# EasyEDA Pro project PicoKey.epro

# Schematic Schematic1
Board Name: Board1; Create Date: 2025-10-05; Page Name: P1; Project Name: PicoKey; Schematic Name: Schematic1; Update Date: 2025-10-05; Company: Astralis; Page Size: A4; Version: V1.0
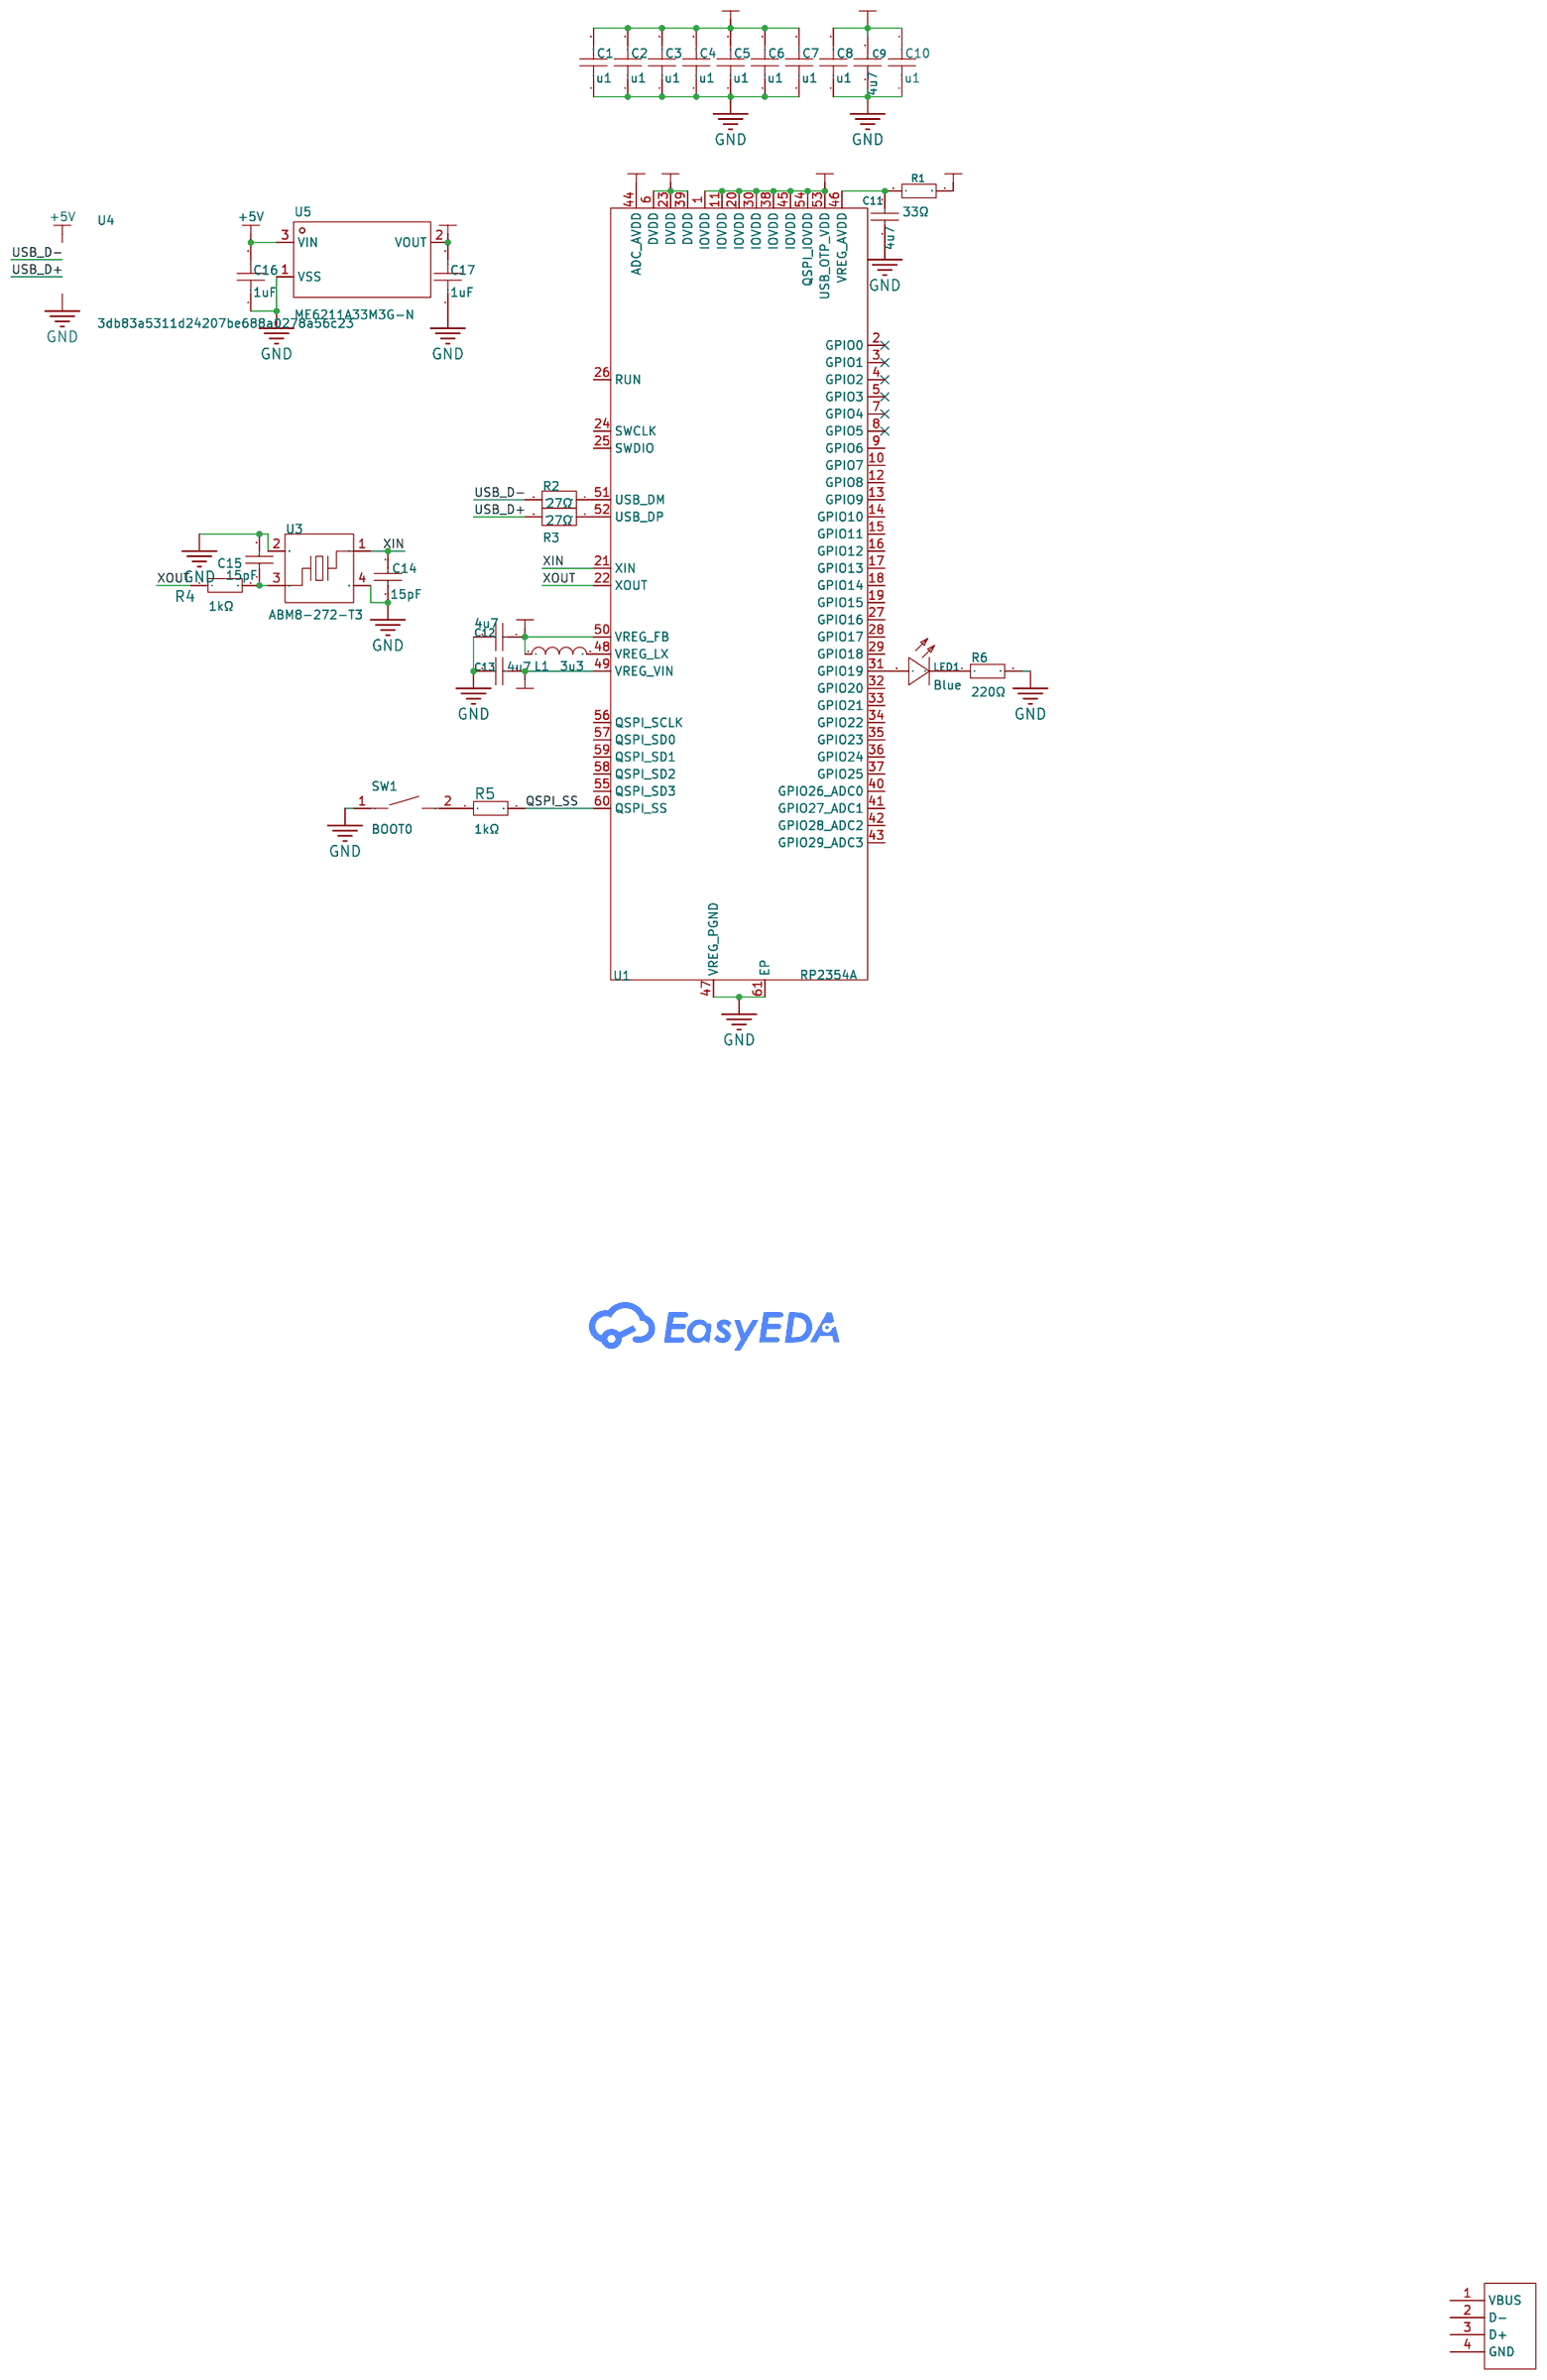
[diagram p0: schematic sheet]

## Parts
C1  u1  [C0402_custom]
C2  u1  [C0402_custom]
C3  u1  [C0402_custom]
C4  u1  [C0402_custom]
C5  u1  [C0402_custom]
C6  u1  [C0402_custom]
C7  u1  [C0402_custom]
C8  u1  [C0402_custom]
C9  4u7  [C0402_custom]
C10  u1  [C0402_custom]
C11  4u7  [C0402_custom]
C12  4u7  [C0402_wider]
C13  4u7  [C0402_wider]
C14  15pF  [C0402_custom]
C15  15pF  [C0402_custom]
C16  1uF  [C0402]
C17  1uF  [C0402]
L1  3u3  [IND-SMD_L2.0-W1.6_AOTA-B201610S3R3-101-T]
LED1  Blue  [LED0402-RD_BLUE]
R1  33Ω  [R0402]
R2  27Ω  [R0402]
R3  27Ω  [R0402]
R4  1kΩ  [R0402]
R5  1kΩ  [R0402]
R6  220Ω  [R0402]
SW1  BOOT0  [SW-SMD_L3.9-W3.0-P4.45]
U1  RP2354A  [QFN-60_L7.0-W7.0-P0.40-TL-EP3.4]
U3  ABM8-272-T3  [CRYSTAL-SMD_4P-L3.2-W2.5-BL]
U4  3db83a5311d24207be688a0278a56c23  [USB-A_PCB]
U5  ME6211A33M3G-N  [SOT-23-3_L2.9-W1.6-P1.90-LS2.8-BR]

## Library data of the parts
C1-C8 C10 = CL05B104KO5NNNC: Capacitance:100nF Tolerance:±10% Tolerance:±10% Voltage Rating:16V Temperature Coefficient:X7R; LCSC Part Name: 100nF ±10% 16V; Supplier Part: C1525; Manufacturer: SAMSUNG(三星); Supplier Footprint: 0402; Datasheet: https://item.szlcsc.com/datasheet/CL05B104KO5NNNC/1877.html; Supplier: LCSC; Tolerance: ±10%; Voltage Rating: 16V; Temperature Coefficient: X7R
C9 C11-C13 = CL05A475MP5NRNC: Capacitance:4.7uF Tolerance:±20% Tolerance:±20% Voltage Rating:10V Temperature Coefficient:X5R; LCSC Part Name: 4.7uF ±20% 10V; Supplier Part: C23733; Manufacturer: SAMSUNG(三星); Supplier Footprint: 0402; Datasheet: https://item.szlcsc.com/datasheet/CL05A475MP5NRNC/24469.html; Supplier: LCSC; Tolerance: ±20%; Voltage Rating: 10V; Temperature Coefficient: X5R
C14 C15 = 0402CG150J500NT: Capacitance: Tolerance:±5% Tolerance:±5% Voltage Rated: Temperature Coefficient:; LCSC Part Name: 15pF ±5% 50V; Supplier Part: C1548; Manufacturer: FH(风华); Supplier Footprint: 0402; JLCPCB Part Class: Basic Part; Datasheet: https://atta.szlcsc.com/upload/public/pdf/source/20200305/C486355_26A10D38EF8C2A5C37091D0039909270.pdf; Supplier: LCSC; Tolerance: ±5%
C16 C17 = CL05A105KA5NQNC: Capacitance:1uF Tolerance:±10% Tolerance:±10% Voltage Rating:25V Temperature Coefficient:X5R; LCSC Part Name: 1uF ±10% 25V; Supplier Part: C52923; Manufacturer: SAMSUNG(三星); Supplier Footprint: 0402; Datasheet: https://item.szlcsc.com/datasheet/CL05A105KA5NQNC/53938.html; Supplier: LCSC; Tolerance: ±10%; Voltage Rating: 25V; Temperature Coefficient: X5R
L1 = AOTA-B201610S3R3-101-T: Supplier Part: C42411119; Manufacturer: ABRACON; Supplier Footprint: 0806; Datasheet: https://item.szlcsc.com/datasheet/AOTA-B201610S3R3-101-T/44392932.html; Supplier: LCSC
LED1 = MHT136UBCT: Emitted Color:Blue Power Dissipation:95mW Forward Current:5mA Dominant Wavelength:460nm~475nm Dominant Wavelength:460nm~475nm Peak Wavelength:468nm Diode Configuration:- Lens Color:无色透明透镜 Color Temperature:- Color Temperature:- Viewing Angle:120° Mounting; LCSC Part Name: 蓝灯; Supplier Part: C401112; Manufacturer: MEIHUA(美华); Supplier Footprint: 0402; Datasheet: https://atta.szlcsc.com/upload/public/pdf/source/20190702/C401112_5DC3FC64C29106EB5A730797BBB1C3EC.pdf; Supplier: LCSC; Power Dissipation: 95mW; Forward Current: 5mA; Dominant Wavelength: 460nm~475nm; Peak Wavelength: 468nm; Lens Color: 无色透明透镜; Viewing Angle: 120°; Operating Temperature: -35℃~+85℃
R1 = 0402WGF330JTCE: Type:Thick Film Resistors Resistance:33Ω Tolerance:±1% Tolerance:±1% Power(Watts): Overload Voltage (Max): Temperature Coefficient:±100ppm/℃ Temperature Coefficient:±100ppm/℃ Operating Temperature Range:-55℃~+155℃ Operating Temperature Range:-55℃~+155℃; LCSC Part Name: 33Ω ±1% 62.5mW 厚膜电阻; Supplier Part: C25105; Manufacturer: UNI-ROYAL(厚声); Supplier Footprint: 0402; Datasheet: https://atta.szlcsc.com/upload/public/pdf/source/20200306/C422600_1E6D84923E4A46A82E41ADD87F860B5C.pdf; Supplier: LCSC; Type: Thick Film Resistors; Tolerance: ±1%; Temperature Coefficient: ±100ppm/℃; Operating Temperature Range: -55℃~+155℃
R2 R3 = WR04X270JTL_C384351: Type:Thick Film Resistor Resistance:27Ω Tolerance:±5% Tolerance:±5% Power(Watts):62.5mW Voltage-Supply(Max):50V Temperature Coefficient:±100ppm/℃ Temperature Coefficient:±100ppm/℃ Operating Temperature:-55℃~+155℃ Operating Temperature:-55℃~+155℃; LCSC Part Name: 厚膜电阻 27Ω ±5% 62.5mW; Supplier Part: C384351; Manufacturer: Walsin(华新科); Manufacturer Part: WR04X270JTL; Supplier Footprint: 0402; JLCPCB Part Class: Extended Part; Datasheet: https://atta.szlcsc.com/upload/public/pdf/source/20191217/C470037_D99261402F77DA8B1D609223749D445A.pdf; Supplier: LCSC; Type: Thick Film Resistor; Tolerance: ±5%; Power(Watts): 62.5mW; Voltage-Supply(Max): 50V; Temperature Coefficient: ±100ppm/℃; Operating Temperature: -55℃~+155℃
R4 R5 = 0402WGF1001TCE: Type:Thick Film Resistors Resistance:1kΩ Tolerance:±1% Tolerance:±1% Power(Watts): Overload Voltage (Max): Temperature Coefficient:±100ppm/℃ Temperature Coefficient:±100ppm/℃ Operating Temperature Range:-55℃~+155℃ Operating Temperature Range:-55℃~+155℃; LCSC Part Name: 1kΩ ±1% 62.5mW 厚膜电阻; Supplier Part: C11702; Manufacturer: UNI-ROYAL(厚声); Supplier Footprint: 0402; JLCPCB Part Class: Basic Part; Datasheet: https://atta.szlcsc.com/upload/public/pdf/source/20200306/C422600_1E6D84923E4A46A82E41ADD87F860B5C.pdf; Supplier: LCSC; Type: Thick Film Resistors; Tolerance: ±1%; Temperature Coefficient: ±100ppm/℃; Operating Temperature Range: -55℃~+155℃
R6 = RC0402FR-07220RL: Type:Thick Film Resistor Resistance:220Ω Tolerance:±1% Tolerance:±1% Power(Watts):62.5mW Voltage-Supply(Max):50V Temperature Coefficient:±100ppm/℃ Temperature Coefficient:±100ppm/℃ Operating Temperature:-55℃~+155℃ Operating Temperature:-55℃~+155℃; LCSC Part Name: 厚膜电阻 220Ω ±1% 62.5mW; Supplier Part: C112291; Manufacturer: YAGEO(国巨); Supplier Footprint: 0402; Datasheet: https://item.szlcsc.com/datasheet/RC0402FR-07220RL/113523.html; Supplier: LCSC; Type: Thick Film Resistor; Tolerance: ±1%; Power(Watts): 62.5mW; Voltage-Supply(Max): 50V; Temperature Coefficient: ±100ppm/℃; Operating Temperature: -55℃~+155℃
SW1 = TS-1088-AR02016: Circuit:SPST Actuator Style:Round Button Operating Force:160gf Mounting Style:Brick nogging Switch Length:4mm Switch Width:3mm Switch Height:2mm Strike Gundam:不带 Contact Current:50mA Voltage Rating (DC):12V Insulation Resistance:100MΩ Actuator/Cap Color:B; LCSC Part Name: 4*3*2mm 立贴 轻触开关; Supplier Part: C720477; Manufacturer: XUNPU(讯普); Supplier Footprint: SMD; Datasheet: https://atta.szlcsc.com/upload/public/pdf/source/20200810/C720475_60D09DD6C54279ADDB2DC25100F1CC11.pdf; Supplier: LCSC; Circuit: SPST; Actuator Style: Round Button; Operating Force: 160gf; Mounting Style: Brick nogging; Switch Length: 4mm; Switch Width: 3mm; Switch Height: 2mm; Strike Gundam: 不带; Contact Current: 50mA; Voltage Rating (DC): 12V; Insulation Resistance: 100MΩ; Actuator/Cap Color: Black; Pin Style: SMDSplicing; Mechanical Life: 10万次; Operating Temperature: -30℃~+80℃
U1 = RP2354A: LCSC Part Name: 微控制器; Supplier Part: C41378174; Manufacturer: Raspberry Pi(树莓派); Supplier Footprint: QFN-60(7x7); Datasheet: https://item.szlcsc.com/datasheet/RP2354A/43147979.html; Supplier: LCSC
U3 = ABM8-272-T3_C20625731: Supplier Part: C20625731; Manufacturer: ABRACON; Supplier Footprint: SMD3225-4P; Datasheet: https://atta.szlcsc.com/upload/public/pdf/source/20240227/A8BE43F636D80F75C9AF5C59EDF21E9A.pdf; Supplier: LCSC
U4 = USB-A_PCB
U5 = ME6211A33M3G-N: Output Type:Fixed Voltage - Supply:6V Output Voltage:3.3V Output Voltage:3.3V Output Current:500mA Power Supply Rejection Ratio (PSRR):70dB@(1kHz) Voltage Dropout:120mV@(100mA) standby current:60uA Noise:50uVrms Features:Over Current Protection；Enable；Sho; LCSC Part Name: 输入6V 输出3.3V 500mA; Supplier Part: C168807; Manufacturer: MICRONE(南京微盟); Supplier Footprint: SOT-23-3; Datasheet: https://atta.szlcsc.com/upload/public/pdf/source/20180224/C168807_15194366627921363679.pdf; Supplier: LCSC; Output Type: Fixed; Voltage - Supply: 6V; Output Voltage: 3.3V; Output Current: 500mA; Power Supply Rejection Ratio (PSRR): 70dB@(1kHz); Voltage Dropout: 120mV@(100mA); standby current: 60uA; Noise: 50uVrms; Features: Over Current Protection；Enable；Short Circuit Protection; Operating Temperature: -40℃~+150℃; Output Configuration: Positive; Number of Outputs: 1

## Nets
+1V1: C8.2 C9.2 C10.2 C12.1 L1.1 U1.6(DVDD) U1.23(DVDD) U1.39(DVDD) U1.50(VREG_FB)
+3V3: C1.2 C2.2 C3.2 C4.2 C5.2 C6.2 C7.2 C13.1 C17.2 R1.2 U1.1(IOVDD) U1.11(IOVDD) U1.20(IOVDD) U1.30(IOVDD) U1.38(IOVDD) U1.44(ADC_AVDD) U1.45(IOVDD) U1.49(VREG_VIN) U1.53(USB_OTP_VDD) U1.54(QSPI_IOVDD) U5.2(VOUT)
+5V: C16.2 U5.3(VIN)
GND: C1.1 C2.1 C3.1 C4.1 C5.1 C6.1 C7.1 C8.1 C9.1 C10.1 C11.1 C12.2 C13.2 C14.1 C15.2 C16.1 C17.1 R6.2 SW1.1 U1.47(VREG_PGND) U1.61(EP) U3.2(GND) U3.4(GND) U5.1(VSS)
QSPI_SS: R5.2 U1.60(QSPI_SS)
USB_D+: R3.2
USB_D-: R2.2
XIN: C14.2 U1.21(XIN) U3.1
XOUT: R4.1 U1.22(XOUT)
$1N604: L1.2 U1.48(VREG_LX)
$1N1301: C11.2 R1.1 U1.46(VREG_AVDD)
$1N3176: R2.1 U1.51(USB_DM)
$1N3178: R3.1 U1.52(USB_DP)
$1N4151: C15.1 R4.2 U3.3
$1N4442: R5.1 SW1.2
$1N6508: LED1.2(A) U1.31(GPIO19)
$1N6588: LED1.1(K) R6.1

Not connected (* = marked no-connect by the designer): U1 2(GPIO0)* 3(GPIO1)* 4(GPIO2)* 5(GPIO3)* 7(GPIO4)* 8(GPIO5)* 9(GPIO6) 10(GPIO7) 12(GPIO8) 13(GPIO9) 14(GPIO10) 15(GPIO11) 16(GPIO12) 17(GPIO13) 18(GPIO14) 19(GPIO15) 24(SWCLK) 25(SWDIO) 26(RUN) 27(GPIO16) 28(GPIO17) 29(GPIO18) 32(GPIO20) 33(GPIO21) 34(GPIO22) 35(GPIO23) 36(GPIO24) 37(GPIO25) 40(GPIO26_ADC0) 41(GPIO27_ADC1) 42(GPIO28_ADC2) 43(GPIO29_ADC3) 55(QSPI_SD3) 56(QSPI_SCLK) 57(QSPI_SD0) 58(QSPI_SD2) 59(QSPI_SD1); U4 1(VBUS) 2(D-) 3(D+) 4(GND)

# Board PCB1
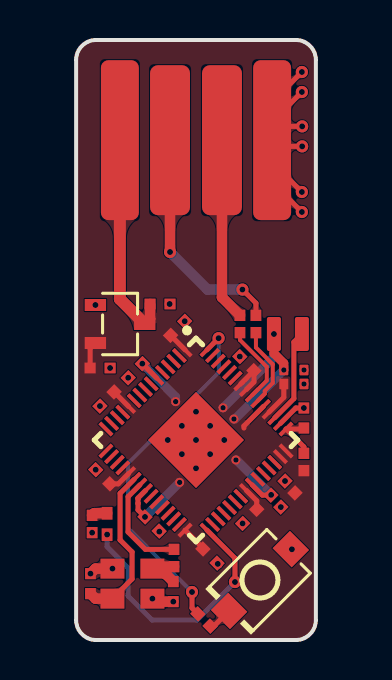
[diagram p1: board, top side]
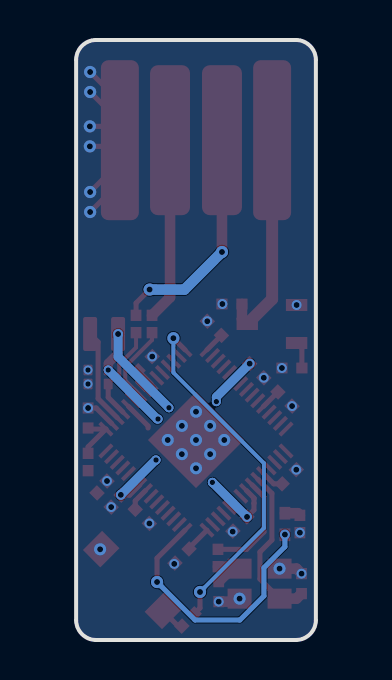
[diagram p2: board, bottom side, seen from below]

Outline 12 x 30 mm; copper layers: Top Layer, Bottom Layer. Coordinates in mm from the lower left corner of the outline.
Outline path: 0,29 0,1 arc(0.29,0.29) 1,0 11,0 arc(11.71,0.29) 12,1 12,29 arc(11.71,29.71) 11,30 1,30 arc(0.29,29.71) 0,29
Stack: Top Layer 0.035mm / Dielectric1 1.51mm FR4 er 4.5 / Bottom Layer 0.035mm

## Design rules (mm)
template: Custom Config
spacing copperThickness1oz (default): track to track 0.102, other pairs 0.152 to 0.3
spacing copperThickness2oz: track to track 0.203, other pairs 0.152 to 0.3
track width copperThickness1oz (default): min 0.127, default 0.254, max 2.54
track width copperThickness2oz: min 0.203, default 0.254, max 2.54
differential pair differentialPair (default): width min 0.127, default 0.254, max 2.54; gap min 0.152, default 0.152
via viaSize (default): diameter min 0.4, default 0.61, max 10; hole min 0.2, default 0.3, max 6.3

## Placement (name value [footprint] x y rotation side)
C1  u1  [C0402_custom]  5.08 15.59 225 top
C2  u1  [C0402_custom]  1.55 12.05 45 top
C3  u1  [C0402_custom]  1.33 8.16 315 top
C4  u1  [C0402_custom]  6.7 4.2 135 top
C5  u1  [C0402_custom]  8.69 6.18 45 top
C6  u1  [C0402_custom]  10.6 7 45 top
C7  u1  [C0402_custom]  8.55 13.82 315 top
C8  u1  [C0402_custom]  2.96 13.47 45 top
C9  4u7  [C0402_custom]  3.8 5.8 135 top
C10  u1  [C0402_custom]  10.1 7.6 225 top
C11  4u7  [C0402_custom]  11.4 11.1 270 top
C12  4u7  [C0402_wider]  10.9 13.5 0 top
C13  4u7  [C0402_wider]  10.9 12.8 0 top
C14  15pF  [C0402_custom]  0.72 2.82 270 top
C15  15pF  [C0402_custom]  4.86 2.42 270 top
C16  1uF  [C0402]  4.2 16.8 180 top
C17  1uF  [C0402]  1.2 13.6 180 top
L1  3u3  [IND-SMD_L2.0-W1.6_AOTA-B201610S3R3-101-T]  10.6 15.3 0 top
LED1  Blue  [LED0402-RD_BLUE]  1.55 5.8 270 top
R1  33Ω  [R0402]  11.4 8.9 270 top
R2  27Ω  [R0402]  9 15.8 90 top
R3  27Ω  [R0402]  8.2 15.8 90 top
R4  1kΩ  [R0402]  4.9 4.1 270 top
R5  1kΩ  [R0402]  6.4 1 135 top
R6  220Ω  [R0402]  0.8 5.8 270 top
SW1  BOOT0  [SW-SMD_L3.9-W3.0-P4.45]  9.2 3 225 top
U1  RP2354A  [QFN-60_L7.0-W7.0-P0.40-TL-EP3.4]  6 10 315 top
U3  ABM8-272-T3  [CRYSTAL-SMD_4P-L3.2-W2.5-BL]  2.82 2.82 0 top
U4  3db83a5311d24207be688a0278a56c23  [USB-A_PCB]  6 20.8 90 top
U5  ME6211A33M3G-N  [SOT-23-3_L2.9-W1.6-P1.90-LS2.8-BR]  2.2 15.8 180 top

## Footprints (pads in the part's own frame, mm; a bottom-side part is the same pattern mirrored in y, then rotated)
C0402
  rect 0.56x0.54 smd: 1(-0.5,0) 2(0.5,0)
C0402_custom
  rect 0.56x0.54 smd: 1(-0.5,0) 2(0.5,0)
C0402_wider
  rrect 0.45x0.53 smd: 1(-0.505,0) 2(0.505,0)
CRYSTAL-SMD_4P-L3.2-W2.5-BL
  rect 1.2x1 smd: 1(-1,-0.75) 2(1,-0.75) 3(1,0.75) 4(-1,0.75)
IND-SMD_L2.0-W1.6_AOTA-B201610S3R3-101-T
  rrect 0.7x1.7 smd: 1(-0.7,0) 2(0.7,0)
LED0402-RD_BLUE
  rect 0.636x0.54 smd: 1(-0.538,0) 2(0.538,0)
QFN-60_L7.0-W7.0-P0.40-TL-EP3.4
  rect 0.875x0.2 smd: 1(-3.575,2.8) 2(-3.575,2.4) 3(-3.575,2) 4(-3.575,1.6) 5(-3.575,1.2) 6(-3.575,0.8) 7(-3.575,0.4) 8(-3.575,0) 9(-3.575,-0.4) 10(-3.575,-0.8) 11(-3.575,-1.2) 12(-3.575,-1.6) 13(-3.575,-2) 14(-3.575,-2.4) 15(-3.575,-2.8) 31(3.575,-2.8) 32(3.575,-2.4) 33(3.575,-2.001) 34(3.575,-1.6) 35(3.575,-1.2) 36(3.575,-0.8) 37(3.575,-0.4) 38(3.575,-0.001) 39(3.575,0.4) 40(3.575,0.8) 41(3.575,1.2) 42(3.575,1.6) 43(3.575,2) 44(3.575,2.4) 45(3.575,2.8)
  rect 0.2x0.875 smd: 16(-2.8,-3.575) 17(-2.4,-3.575) 18(-2,-3.575) 19(-1.6,-3.575) 20(-1.2,-3.575) 21(-0.8,-3.575) 22(-0.4,-3.575) 23(0,-3.575) 24(0.4,-3.575) 25(0.8,-3.575) 26(1.2,-3.575) 27(1.6,-3.575) 28(2,-3.575) 29(2.4,-3.575) 30(2.8,-3.575) 46(2.8,3.575) 47(2.4,3.575) 48(2,3.575) 49(1.6,3.575) 50(1.2,3.575) 51(0.8,3.575) 52(0.4,3.575) 53(0,3.575) 54(-0.4,3.575) 55(-0.8,3.575) 56(-1.2,3.575) 57(-1.6,3.575) 58(-2,3.575) 59(-2.4,3.575) 60(-2.8,3.575)
  rect 3.4x3.4 smd: 61(0,0)
R0402
  rect 0.566x0.54 smd: 1(-0.433,0) 2(0.433,0)
SOT-23-3_L2.9-W1.6-P1.90-LS2.8-BR
  rect 1.07x0.6 smd: 1(1.235,-0.95) 2(1.235,0.95) 3(-1.235,0)
SW-SMD_L3.9-W3.0-P4.45
  rect 1.23x1.36 smd: 1(-2.185,0) 2(2.185,0)
USB-A_PCB
  rrect 8x1.9 smd: 1(4.191,3.81) 4(4.191,-3.81)
  rrect 7.5x2 smd: 2(4.191,1.3) 3(4.191,-1.3)

## Nets
+1V1: C8.2 C9.2 C10.2 C12.1 L1.1 U1.6 U1.23 U1.39 U1.50
+3V3: C1.2 C2.2 C3.2 C4.2 C5.2 C6.2 C7.2 C13.1 C17.2 R1.2 U1.1 U1.11 U1.20 U1.30 U1.38 U1.44 U1.45 U1.49 U1.53 U1.54 U5.2
+5V: C16.2 U4.1 U5.3
GND: C1.1 C2.1 C3.1 C4.1 C5.1 C6.1 C7.1 C8.1 C9.1 C10.1 C11.1 C12.2 C13.2 C14.1 C15.2 C16.1 C17.1 R6.2 SW1.1 U1.47 U1.61 U3.2 U3.4 U4.4 U5.1
QSPI_SS: R5.2 U1.60
USB_D+: R3.2 U4.3
USB_D-: R2.2 U4.2
XIN: C14.2 U1.21 U3.1
XOUT: R4.1 U1.22
$1N604: L1.2 U1.48
$1N1301: C11.2 R1.1 U1.46
$1N3176: R2.1 U1.51
$1N3178: R3.1 U1.52
$1N4151: C15.1 R4.2 U3.3
$1N4442: R5.1 SW1.2
$1N6508: LED1.2 U1.31
$1N6588: LED1.1 R6.1

Pads without a net: U1 2 3 4 5 7 8 9 10 12 13 14 15 16 17 18 19 24 25 26 27 28 29 32 33 34 35 36 37 40 41 42 43 55 56 57 58 59

## Via types
v1: diameter 0.5, hole 0.3, Top Layer to Bottom Layer, 22 vias
v2: diameter 0.61, hole 0.3, Top Layer to Bottom Layer, 23 vias
v3: diameter 0.45, hole 0.27, Top Layer to Bottom Layer, 8 vias

## Routing (per net, layer and track width the routed paths; a pad name or vN(x,y) marks a point on that pad's centre or on a via; arc(x,y) is an arc through that point)
+1V1: length 23.1
  Top Layer w0.254: U1.23 3.1,7.1 3.1,7.07 3.1,7.07 3.1,6.83 3.1,6.83 3.1,6.5 v1(3.45,6.15) ; U1.50 8.4,10.7 8.4,10.6 ; C10.2 9.32,7.24 8.81,7.75 ; v1(3.31,13.82) U1.6
  Top Layer w0.45: v3(10.4,13.5) 10.4,13.84 9.9,14.33 v1(9.9,15.3)
  Bottom Layer w0.45: v3(10.4,13.5) 7.94,11.05 v3(7.9,11.05) ; v3(8,9) 8.02,9 v1(9.76,7.26) ; v1(9.9,15.3) 9.9,14.16 v3(7.35,11.61) ; v1(3.45,6.15) 5.17,7.88 v3(5.18,7.88) ; v1(3.31,13.82) 4.98,12.15 v3(4.98,11.92)
+3V3: length 11
  Top Layer w0.254: U1.1 4.66,15.3 ; U1.11 1.83,12.47 ; U1.49 10.4,12.13 C13.1 ; U1.38 9.04,6.96 C5.2 ; 6.45,4.5 U1.30 ; C17.2 0.7,14.58 U5.2 ; U1.53 8.9,12.9 C7.2 8.25,12.81 ; C3.2 2.11,7.81 U1.20
+5V: length 9.6
  Top Layer w0.53: C16.2 3.7,16.06 U5.3
  Top Layer w0.6: 2.19,23.79 2.19,17.05 U5.3
GND: length 19.7
  Top Layer w0.254: U1.47 10.99,11.6 v1(11.4,11.6) ; v2(11.31,25.68) 10.5,25.68 U4.4 ; v2(11.3,27.4) 9.81,25.91 ; 9.81,25.91 U4.4 ; 9.81,25.91 9.81,26.91 v2(11.3,28.4) ; v2(11.3,21.4) 9.81,22.89 9.81,23.89 ; 9.81,23.89 U4.4 ; 9.81,23.89 v2(11.3,22.4) ; U4.4 10.12,24.68 v2(11.31,24.68)
  Top Layer w0.53: v1(0.72,3.32) 0.97,3.57 v2(1.82,3.57) ; v1(4.86,1.92) 3.97,1.92 v2(3.82,2.07)
  vias: v1(0.8,5.37) v1(0.97,16.75) v1(0.98,8.52) v1(1.19,11.7) v1(1.7,13.6) v1(2.61,13.11) v1(4.16,5.42) v1(4.68,16.8) v1(5.43,15.94) v1(7.09,3.81) v1(8.19,14.17) v1(8.33,5.83) v1(10.25,6.65) v1(10.46,7.95) v2(4.59,10) v2(5.29,10.71) v2(5.29,9.29) v2(6,11.41) v2(6,10) v2(6,8.59) v2(6.71,10.71) v2(6.71,9.29) v2(7.41,10) v2(10.8,4.54) v3(11.41,13.5) v3(11.41,12.8)
QSPI_SS: length 17.9
  Top Layer w0.254: R5.2 5.8,1.6 v2(5.8,2.4) ; U1.60 v2(7.13,15.09)
  Bottom Layer w0.2: v2(5.8,2.4) 2.6,5.6 2.6,8.84 7.13,13.37 v2(7.13,15.09)
USB_D+: length 7.9
  Top Layer w0.53: R3.2 7.3,17.13 7.3,23.79
USB_D-: length 10.4
  Top Layer w0.254: R2.2 9,16.85 v2(8.32,17.52)
  Top Layer w0.53: v2(4.7,19.4) 4.7,23.79
  Bottom Layer w0.53: v2(4.7,19.4) 6.58,17.52 v2(8.32,17.52)
XIN: length 8.1
  Top Layer w0.254: U1.21 2.2,7.33 2.2,5 2.8,4.4 2.8,3.05 U3.1
  Top Layer w0.53: U3.1 0.97,2.07 C14.2
XOUT: length 5.3
  Top Layer w0.254: 3.19,7.75 2.6,7.17 2.6,5.4 3.47,4.53 R4.1
$1N604: length 4.7
  Top Layer w0.254: U1.48 10.9,12.07 10.9,14.9 L1.2
$1N1301: length 2.5
  Top Layer w0.254: C11.2 11.35,10.55 U1.46 11.4,9.66 11.4,9.33
$1N3176: length 3.9
  Top Layer w0.2: 9,15.17 9,14.63 9.84,13.78 9.84,12.85 9.44,12.45 9.44,12.31 U1.51
$1N3178: length 3.8
  Top Layer w0.2: 8.2,15.17 8.2,15 9.54,13.66 9.54,12.97 8.81,12.25
$1N4151: length 2
  Top Layer w0.53: 4.21,3.57 4.31,3.67 4.9,3.67 ; 4.21,3.57 U3.3 ; 4.21,3.57 C15.1
$1N4442: length 1.3
  Top Layer w0.254: R5.1 6.89,0.69 7.66,1.45
$1N6508: length 13.3
  Top Layer w0.254: v2(7.95,2.9) 7.95,4.09 U1.31
  Bottom Layer w0.254: v1(1.55,5.27) 1.55,4.66 2.6,3.61 2.6,2.2 3.8,1 6.05,1 v2(7.95,2.9)
$1N6588: length 0.8
  Top Layer w0.53: LED1.1 0.91,6.34 R6.1

## Copper pours and planes (outline as drawn; the poured copper is in the pictures)
+1V1 on Top Layer: 2.69,10 6.01,13.32 9.34,10 6.01,6.67
+3V3 on Top Layer: 0,30 12,30 12,0 0,0
GND on Bottom Layer: 0,30 12,30 12,0 0,0

Small or netless copper shapes (teardrops, artwork), in the pictures only: 55 on Top Layer, 15 on Bottom Layer
